# Altium schematic sheet sch_Camera.SchDoc
size A4
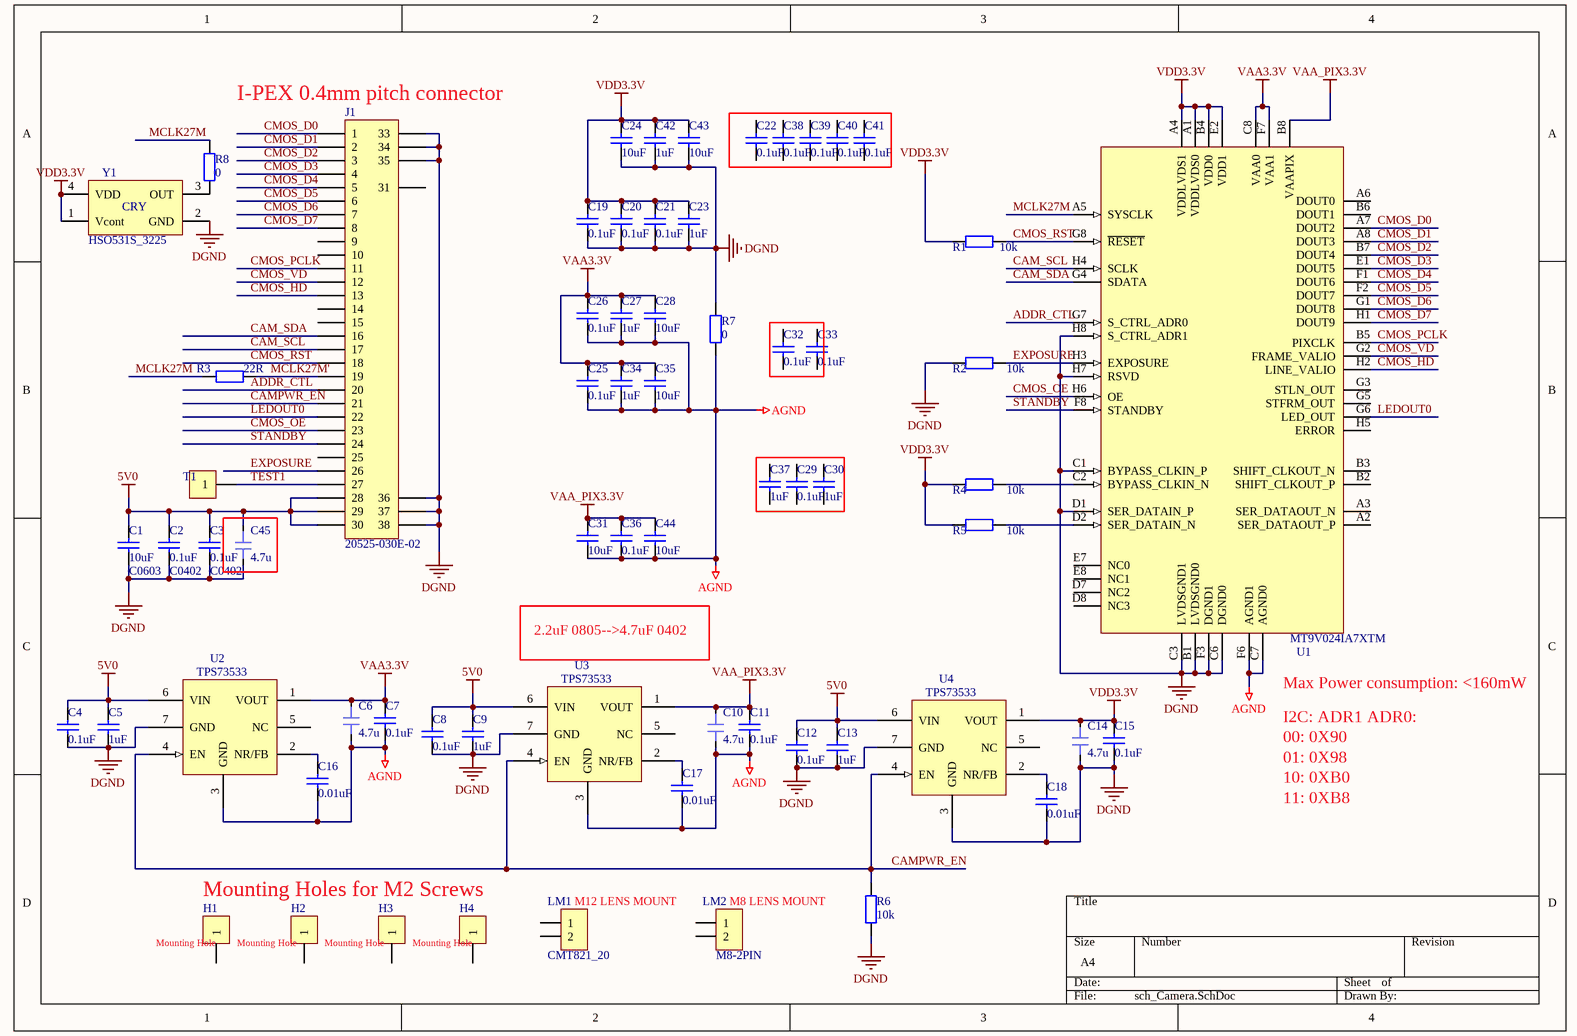
[diagram p0: sch_Camera.SchDoc]

## Parts
C1  10uF  value C0603  [0805C]
C2  0.1uF  value C0402  [0402C]
C3  0.1uF  value C0402  [0402C]
C4  0.1uF  [0402C]
C5  1uF  [0402C]
C6  4.7u  [0402C]
C7  0.1uF  [0402C]
C8  0.1uF  [0402C]
C9  1uF  [0402C]
C10  4.7u  [0402C]
C11  0.1uF  [0402C]
C12  0.1uF  [0402C]
C13  1uF  [0402C]
C14  4.7u  [0402C]
C15  0.1uF  [0402C]
C16  0.01uF  [0402C]
C17  0.01uF  [0402C]
C18  0.01uF  [0402C]
C19  0.1uF  [0402C]
C20  0.1uF  [0402C]
C21  0.1uF  [0402C]
C22  0.1uF  [0402C]
C23  1uF  [0402C]
C24  10uF  [0805C]
C25  0.1uF  [0402C]
C26  0.1uF  [0402C]
C27  1uF  [0402C]
C28  10uF  [0805C]
C29  0.1uF  [0402C]
C30  1uF  [0402C]
C31  10uF  [0805C]
C32  0.1uF  [0402C]
C33  0.1uF  [0402C]
C34  1uF  [0402C]
C35  10uF  [0805C]
C36  0.1uF  [0402C]
C37  1uF  [0402C]
C38  0.1uF  [0402C]
C39  0.1uF  [0402C]
C40  0.1uF  [0402C]
C41  0.1uF  [0402C]
C42  1uF  [0402C]
C43  10uF  [0805C]
C44  10uF  [0805C]
C45  4.7u  [0402C]
H1  CON1  [PAD_M3_D350_450]  (value not drawn)
H2  CON1  [PAD_M3_D350_450]  (value not drawn)
H3  CON1  [PAD_M3_D350_450]  (value not drawn)
H4  CON1  [PAD_M3_D350_450]  (value not drawn)
J1  20525-030E-02  [HSA30_P40L196W42H10_20525]
LM1  CMT821_20  [PAD_M3_D350_450]
LM2  M8-2PIN  [PAD_M3_D350_450]
R1  10K  [0402R]
R2  10K  [0402R]
R3  22R  [0402R]
R4  10K  [0402R]
R5  10K  [0402R]
R6  10K  [0402R]
R7  value 0  [0402R]  (hidden comment: 0R)
R8  value 0  [0402R]  (hidden comment: 0R)
T1  CON1  [PAD_TP_D1.2]  (value not drawn)
U1  MT9V024IA7XTM  [IBGA52_8X8_P100L90W90H90R]
U2  TPS73533  [QFN8_P65L30W30H10_DRB]
U3  TPS73533  [QFN8_P65L30W30H10_DRB]
U4  TPS73533  [QFN8_P65L30W30H10_DRB]
Y1  HSO531S_3225  [XTAL_3225]

## Nets
5V0: C1.2 C2.2 C3.2 C4.2 C5.2 C8.2 C9.2 C12.2 C13.2 C45.1 J1.28 J1.29 J1.30 U2.6(VIN) U3.6(VIN) U4.6(VIN)
AGND: C6.2 C7.1 C10.2 C11.1 C16.1 C17.1 C25.1 C26.1 C27.1 C28.1 C31.1 C34.1 C35.1 C36.1 C44.1 R7.2 U1.C7(AGND0) U1.F6(AGND1) U2.3(GND) U3.3(GND)
DGND: C1.1 C2.1 C3.1 C4.1 C5.1 C8.1 C9.1 C12.1 C13.1 C14.2 C15.1 C18.1 C19.1 C20.1 C21.1 C23.1 C24.1 C42.1 C43.1 C45.2 J1.33 J1.34 J1.35 J1.36 J1.37 J1.38 R2.2 R6.1 R7.1 U1.B1(LVDSGND0) U1.C1(BYPASS_CLKIN_P) U1.C3(LVDSGND1) U1.C6(DGND0) U1.D1(SER_DATAIN_P) U1.F3(DGND1) U1.H7(RSVD) U1.H8(S_CTRL_ADR1) U2.7(GND) U3.7(GND) U4.3(GND) U4.7(GND) Y1.2(GND)
VAA3.3V: C6.1 C7.2 C25.2 C26.2 C27.2 C28.2 C34.2 C35.2 U1.C8(VAA0) U1.F7(VAA1) U2.1(VOUT)
VAA_PIX3.3V: C10.1 C11.2 C31.2 C36.2 C44.2 U1.B8(VAAPIX) U3.1(VOUT)
VDD3.3V: C14.1 C15.2 C19.2 C20.2 C21.2 C23.2 C24.2 C42.2 C43.2 R1.2 R4.2 R5.2 U1.A1(VDDLVDS0) U1.A4(VDDLVDS1) U1.B4(VDD0) U1.E2(VDD1) U4.1(VOUT) Y1.1(Vcont) Y1.4(VDD)
ADDR_CTL: J1.20 U1.G7(S_CTRL_ADR0)
CAM_SCL: J1.17 U1.H4(SCLK)
CAM_SDA: J1.16 U1.G4(SDATA)
CAMPWR_EN: J1.21 R6.2 U2.4(EN) U3.4(EN) U4.4(EN)
CMOS_D0: J1.1 U1.A7(DOUT2)
CMOS_D1: J1.2 U1.A8(DOUT3)
CMOS_D2: J1.3 U1.B7(DOUT4)
CMOS_D3: J1.4 U1.E1(DOUT5)
CMOS_D4: J1.5 U1.F1(DOUT6)
CMOS_D5: J1.6 U1.F2(DOUT7)
CMOS_D6: J1.7 U1.G1(DOUT8)
CMOS_D7: J1.8 U1.H1(DOUT9)
CMOS_HD: J1.13 U1.H2(LINE_VALIO)
CMOS_OE: J1.23 U1.H6(OE)
CMOS_PCLK: J1.11 U1.B5(PIXCLK)
CMOS_RST: J1.18 R1.1 U1.G8(~{RESET})
CMOS_VD: J1.12 U1.G2(FRAME_VALIO)
EXPOSURE: J1.26 R2.1 U1.H3(EXPOSURE)
LEDOUT0: J1.22 U1.G6(LED_OUT)
MCLK27M: R3.1 R8.1 U1.A5(SYSCLK)
MCLK27M': J1.19 R3.2
STANDBY: J1.24 U1.F8(STANDBY)
TEST1: J1.27 T1.1
NetC16_2: C16.2 U2.2(NR/FB)
NetC17_2: C17.2 U3.2(NR/FB)
NetC18_2: C18.2 U4.2(NR/FB)
NetR4_1: R4.1 U1.C2(BYPASS_CLKIN_N)
NetR5_1: R5.1 U1.D2(SER_DATAIN_N)
NetR8_2: R8.2 Y1.3(OUT)

Not connected (* = marked no-connect by the designer): C22 1 2; C29 1 2; C30 1 2; C32 1 2; C33 1 2; C37 1 2; C38 1 2; C39 1 2; C40 1 2; C41 1 2; H1 1; H2 1; H3 1; H4 1; J1 9 10 14 15 25 31; LM1 1 2; LM2 1 2; U1 A2(SER_DATAOUT_P) A3(SER_DATAOUT_N) A6(DOUT0) B2(SHIFT_CLKOUT_P) B3(SHIFT_CLKOUT_N) B6(DOUT1) D7(NC2) D8(NC3) E7(NC0) E8(NC1) G3(STLN_OUT) G5(STFRM_OUT) H5(ERROR); U2 5(NC); U3 5(NC); U4 5(NC)

## Notes on the sheet
- (near J1) I-PEX 0.4mm pitch connector
- 2.2uF 0805-->4.7uF 0402
- (near U1) Max Power consumption: <160mW
- I2C: ADR1 ADR0:
- 00: 0X90
- 01: 0X98
- 10: 0XB0
- 11: 0XB8
- Mounting Holes for M2 Screws
- (near LM1) M12 LENS MOUNT
- (near LM2) M8 LENS MOUNT
- (near H1) Mounting Hole
- (near H2) Mounting Hole
- (near H3) Mounting Hole
- (near H4) Mounting Hole

## Library data of the parts
C1-C5 C7-C9 C11-C13 C15-C44 = Cap: Capacitor; Published: 8-Jun-2000; LatestRevisionDate: 17-Jul-2002; LatestRevisionNote: Re-released for DXP Platform.; Publisher: Altium Limited
  C1: PackageReference: RAD-0.3
  C4 C7 C8 C11 C12 C15 C19-C22 C25 C26 C29 C32 C33 C36 C38-C41: Value: 0.1uF
  C5 C9 C13 C23 C27 C30 C34 C37 C42: PackageReference: RAD-0.3; Value: 1uF
  C16-C18: PackageReference: RAD-0.3; Value: 0.01uF
  C24 C28 C31 C35 C43 C44: PackageReference: RAD-0.3; Value: 10uF
C6 C10 C14 C45 = cap0402: CC0402MRX5R5BB475; 元件类别: 贴片电容; 主物料厂家: YAGEO
H1-H4 T1 = CON1: Connector
LM1 LM2 = CON2: Connector
R1-R8 = Resistor: Published: 8-Jun-2000; LatestRevisionDate: 17-Jul-2002; LatestRevisionNote: Re-released for DXP Platform.; PackageReference: AXIAL-0.4; Publisher: Altium Limited
  R1 R2 R4-R6: Value: 10k
  R3: Value: 22R
Y1 = CRY: 有源晶振